# EAGLE design Lawnbot400_arduino33 (EAGLE 5.06)
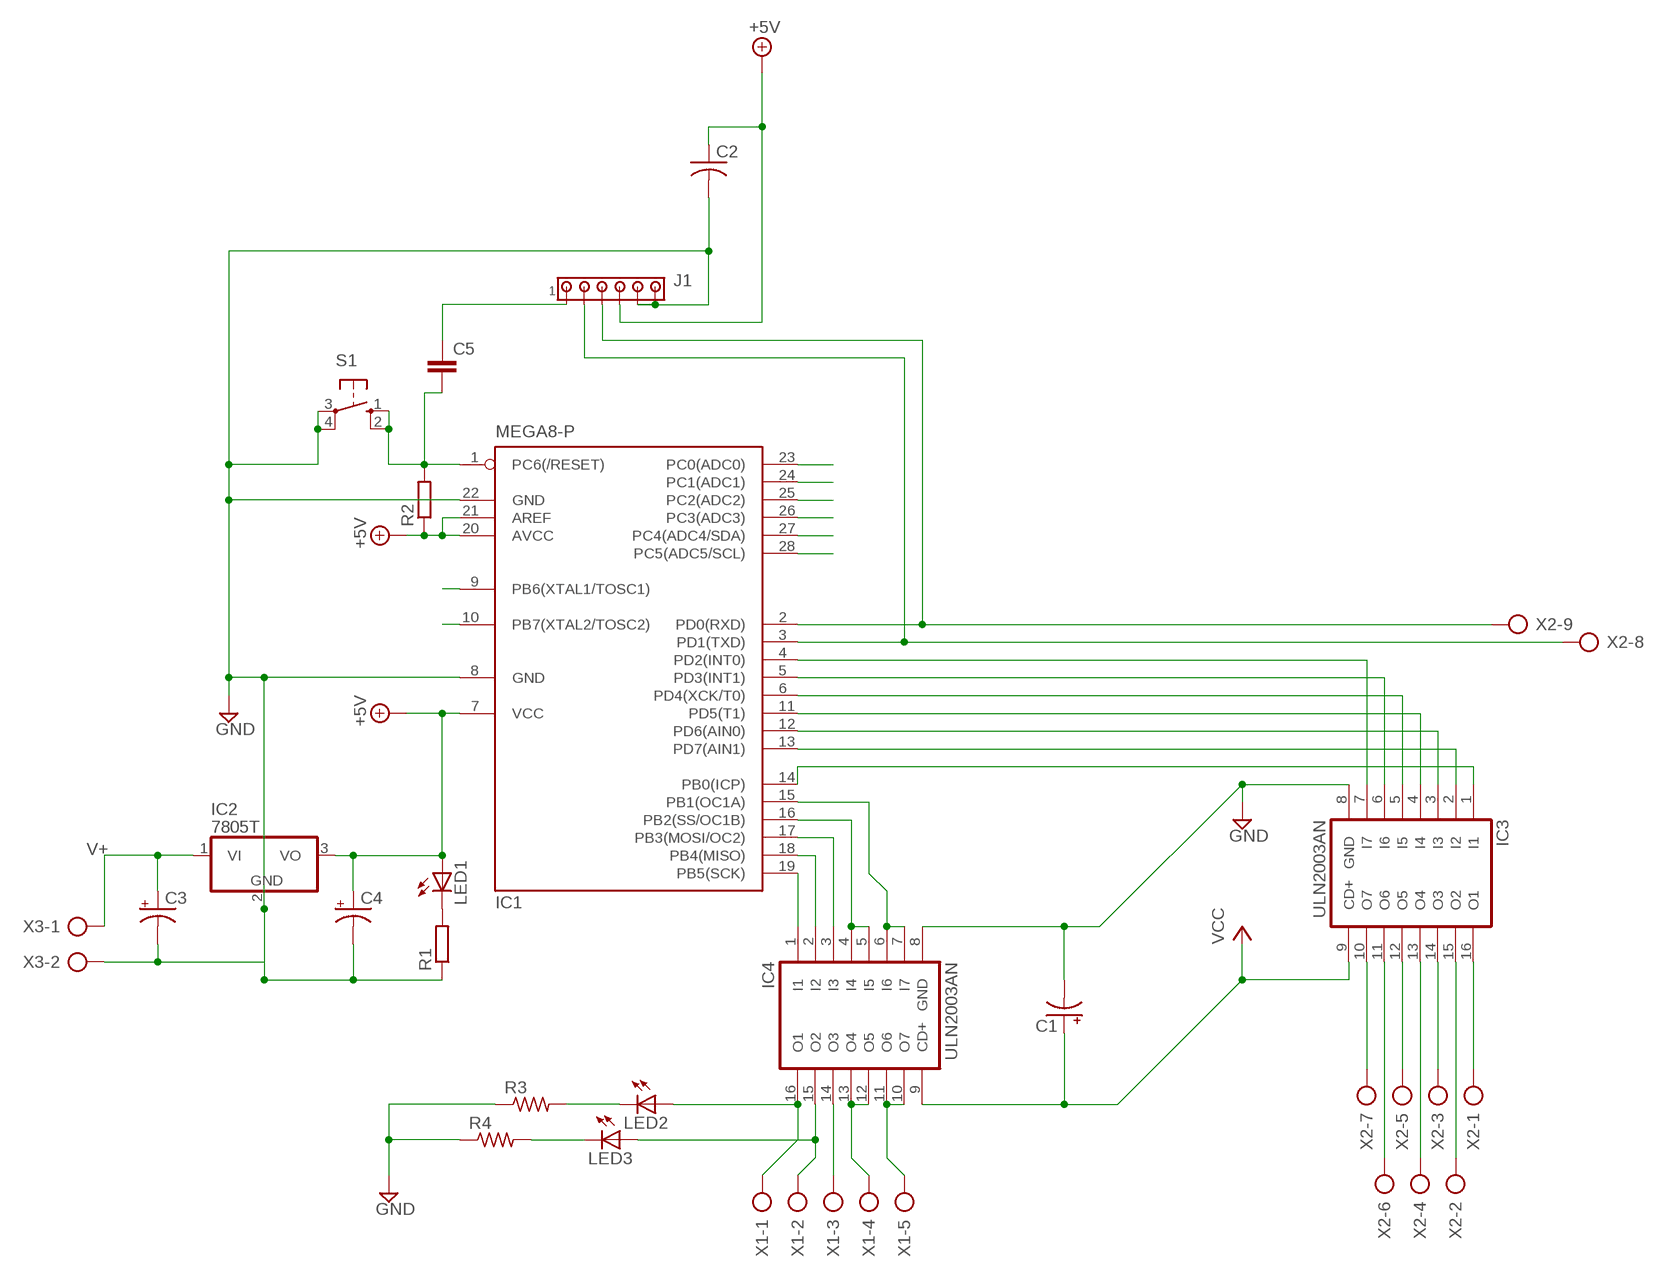
[diagram p0: schematic, sheet 1]

## Parts
C1  CPOL-USE2.5-6  [E2,5-6]
C2  C-US025-024X044  [C025-024X044]
C3  CPOL-USE2.5-6  [E2,5-6]
C4  CPOL-USE2.5-7  [E2,5-7]
C5  C-EU075-042X103  [C075-042X103]
IC1  MEGA8-P  [DIL28-3]
IC2  7805T  [TO220H]
IC3  ULN2003AN  [DIL16]
IC4  ULN2003AN  [DIL16]
J1  MTA06-100  [10X06MTA]
LED1  LED3MM  [LED3MM]
LED2  LED3MM  [LED3MM]
LED3  LED3MM  [LED3MM]
R1  R-EU_0204/5  [0204/5]
R2  R-EU_0204/5  [0204/5]
R3  R-US_0204/5  [0204/5]
R4  R-US_0204/5  [0204/5]
S1  10-XX  [B3F-10XX]
X1  AK500/5  [AK500/5]
X2  AK500/9  [AK500/9]
X3  AK500/2  [AK500/2]

## Nets
+5V: C2.1 C4.+ IC1.7(VCC) IC1.20(AVCC) IC1.21(AREF) IC2.3(VO) J1.3 LED1.A R2.1
GND: C1.- C2.2 C3.- C4.- IC1.8(GND) IC1.22(GND) IC2.2(GND) IC3.8(GND) IC4.8(GND) J1.1 J1.2 R1.1 R3.1 R4.1 S1.3(P) S1.4(P1) X3.2
N$1: LED1.K(C) R1.2
N$2: C5.2 IC1.1(PC6(/RESET)) R2.2 S1.1(S) S1.2(S1)
N$3: IC4.16(O1) LED2.A X1.1
N$4: C5.1 J1.6
N$5: IC1.5(PD3(INT1)) IC3.6(I6)
N$6: IC1.4(PD2(INT0)) IC3.7(I7)
N$7: IC1.10(PB7(XTAL2/TOSC2))
N$8: IC3.16(O1) X2.1
N$9: IC1.2(PD0(RXD)) J1.4 X2.9
N$10: IC1.3(PD1(TXD)) J1.5 X2.8
N$11: IC1.6(PD4(XCK/T0)) IC3.5(I5)
N$12: IC1.11(PD5(T1)) IC3.4(I4)
N$13: IC1.12(PD6(AIN0)) IC3.3(I3)
N$14: IC1.13(PD7(AIN1)) IC3.2(I2)
N$15: IC1.14(PB0(ICP)) IC3.1(I1)
N$16: IC1.15(PB1(OC1A)) IC4.6(I6) IC4.7(I7)
N$17: IC1.16(PB2(SS/OC1B)) IC4.4(I4) IC4.5(I5)
N$18: IC1.17(PB3(MOSI/OC2)) IC4.3(I3)
N$19: IC1.18(PB4(MISO)) IC4.2(I2)
N$20: IC1.19(PB5(SCK)) IC4.1(I1)
N$21: IC3.15(O2) X2.2
N$22: IC3.14(O3) X2.3
N$23: IC1.28(PC5(ADC5/SCL))
N$24: IC1.27(PC4(ADC4/SDA))
N$25: IC1.26(PC3(ADC3))
N$26: IC1.25(PC2(ADC2))
N$27: IC1.24(PC1(ADC1))
N$28: IC1.23(PC0(ADC0))
N$29: IC3.13(O4) X2.4
N$30: IC3.12(O5) X2.5
N$31: IC3.11(O6) X2.6
N$32: IC3.10(O7) X2.7
N$33: IC1.9(PB6(XTAL1/TOSC1))
N$34: IC4.15(O2) LED3.A X1.2
N$35: IC4.14(O3) X1.3
N$36: IC4.12(O5) IC4.13(O4) X1.4
N$38: LED2.K(C) R3.2
N$39: IC4.10(O7) IC4.11(O6) X1.5
N$41: LED3.K(C) R4.2
V+: C3.+ IC2.1(VI) X3.1
VCC: C1.+ IC3.9(CD+) IC4.9(CD+)

## Library data of the parts
C1 C3 C4 = rcl:CPOL-US: POLARIZED CAPACITOR, American symbol
C2 = rcl:C-US: CAPACITOR, American symbol
C5 = rcl:C-EU: CAPACITOR, European symbol
IC1 = atmel:MEGA8-P: MICROCONTROLLER 8 Kbytes FLASH, 1 kbytes SRAM, 512 bytes EEPROM, USART, 4-channel 10 bit ADC, 2-channel 8 bit ADC Pin compatible with Atmega48, ATMega88, ATMega168 Source: avr.lbr
IC2 = linear:78*: Positive VOLTAGE REGULATOR Source: http://cache.national.com/ds/LM/LM78L05.pdf http://www.fairchildsemi.com/ds/LM/LM7805.pdf
IC3 IC4 = uln-udn:ULN2003A: DRIVER ARRAY
J1 = con-amp:MTA06-100: AMP connector
LED1-LED3 = led:LED: LED OSRAM: - CHIPLED LG R971, LG N971, LY N971, LG Q971, LY Q971, LO R971, LY R971 LH N974, LH R974 LS Q976, LO Q976, LY Q976 LO Q996 - Hyper CHIPLED LW Q18S LB Q993, LB Q99A, LB R99A - SideLED LS A670, LO A670, LY A670, LG A670, LP A670 LB A673, LV A673, LT A673, LW A673 LH A674 LY A675 LS A676, LA A676, LO A676, LY A676, LW A676 LS A679, LY A679, LG A679 - Hyper Micro SIDELED® LS Y876, LA Y876, LO Y876, LY Y876 LT Y87S - SmartLED LW L88C, LW L88S LB L89C, LB L89S, LG L890 LS L89K, LO L89K, LY L89K LS L896, LA L896, LO L896, LY L896 - TOPLED LS T670, LO T670, LY T670, LG T670, LP T670 LSG T670, LSP T670, LSY T670, LOP T670, LYG T670 LG T671, LOG T671, LSG T671 LB T673, LV T673, LT T673, LW T673 LH T674 LS T676, LA T676, LO T676, LY T676, LB T676, LH T676, LSB T676, LW T676 LB T67C, LV T67C, LT T67C, LS T67K, LO T67K, LY T67K, LW E67C LS E67B, LA E67B, LO E67B, LY E67B, LB E67C, LV E67C, LT E67C LW T67C LS T679, LY T679, LG T679 LS T770, LO T770, LY T770, LG T770, LP T770 LB T773, LV T773, LT T773, LW T773 LH T774 LS E675, LA E675, LY E675, LS T675 LS T776, LA T776, LO T776, LY T776, LB T776 LHGB T686 LT T68C, LB T68C - Hyper Mini TOPLED® LB M676 - Mini TOPLED Santana® LG M470 LS M47K, LO M47K, LY M47K Source: http://www.osram.convergy.de LUXEON: - LUMILED® LXK2-PW12-R00, LXK2-PW12-S00, LXK2-PW14-U00, LXK2-PW14-V00 LXK2-PM12-R00, LXK2-PM12-S00, LXK2-PM14-U00 LXK2-PE12-Q00, LXK2-PE12-R00, LXK2-PE12-S00, LXK2-PE14-T00, LXK2-PE14-U00 LXK2-PB12-K00, LXK2-PB12-L00, LXK2-PB12-M00, LXK2-PB14-N00, LXK2-PB14-P00, LXK2-PB14-Q00 LXK2-PR12-L00, LXK2-PR12-M00, LXK2-PR14-Q00, LXK2-PR14-R00 LXK2-PD12-Q00, LXK2-PD12-R00, LXK2-PD12-S00 LXK2-PH12-R00, LXK2-PH12-S00 LXK2-PL12-P00, LXK2-PL12-Q00, LXK2-PL12-R00 Source: www.luxeon.com KINGBRIGHT: KA-3528ASYC Source: www.kingbright.com
R1 R2 = resistor:R-EU_: RESISTOR, European symbol
R3 R4 = resistor:R-US_: RESISTOR, American symbol
S1 = switch-omron:10-XX: OMRON SWITCH
X1 = con-ptr500:AK500/5: CONNECTOR
X2 = con-ptr500:AK500/9: CONNECTOR
X3 = con-ptr500:AK500/2: CONNECTOR

## Board
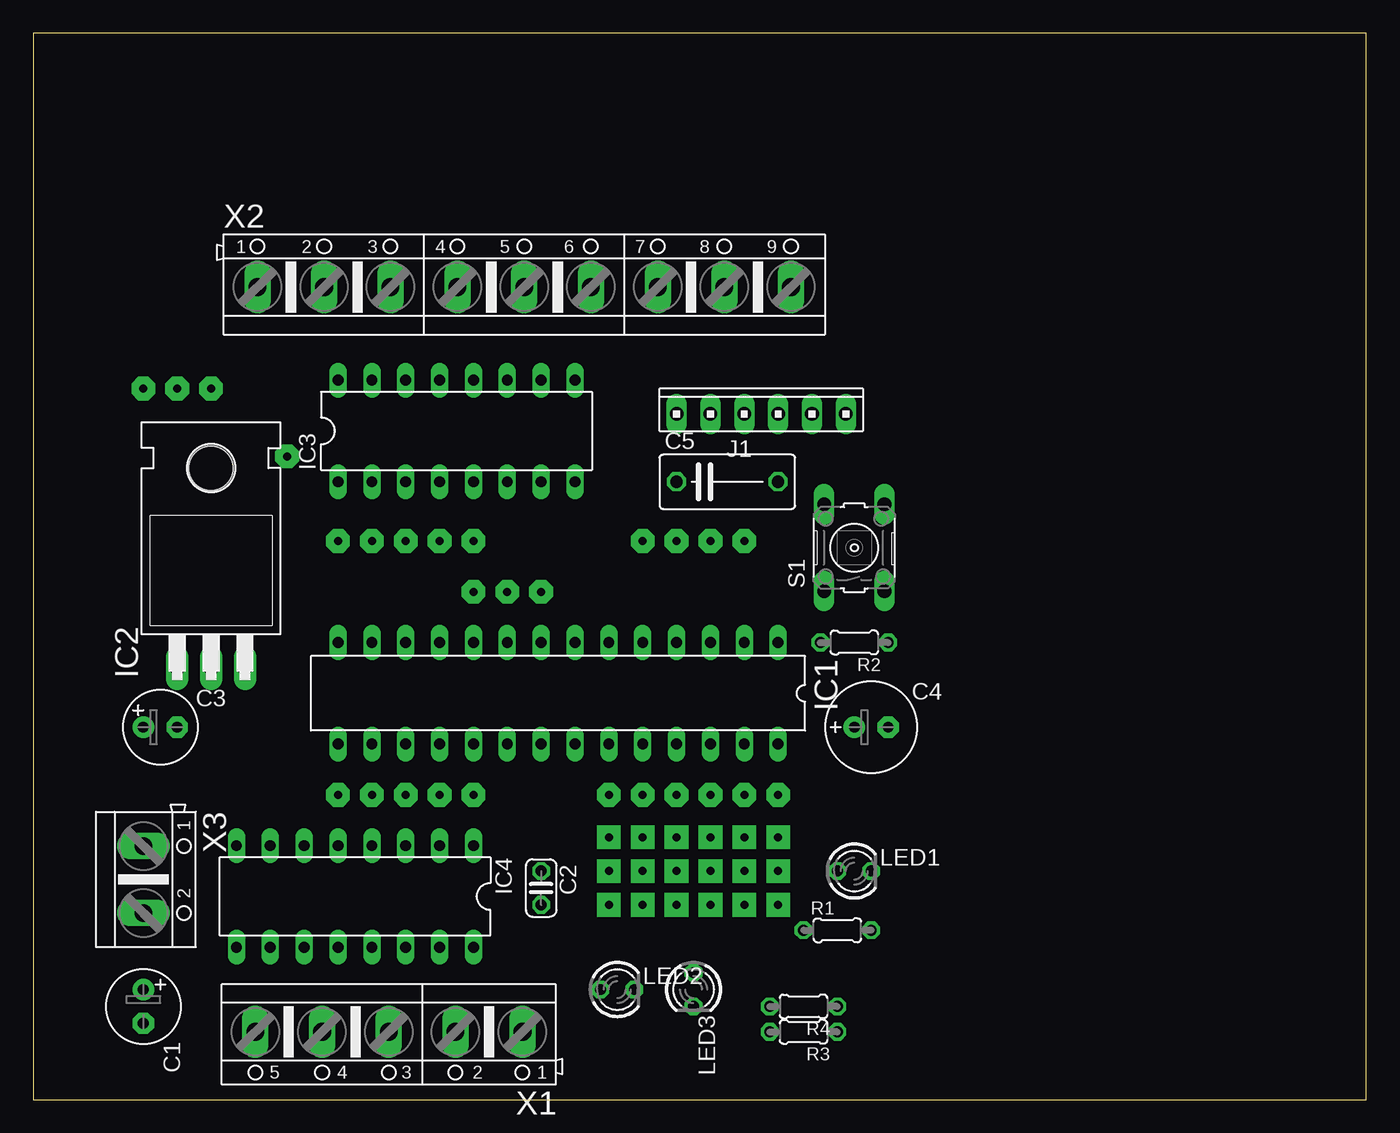
[diagram p1: board, top side]
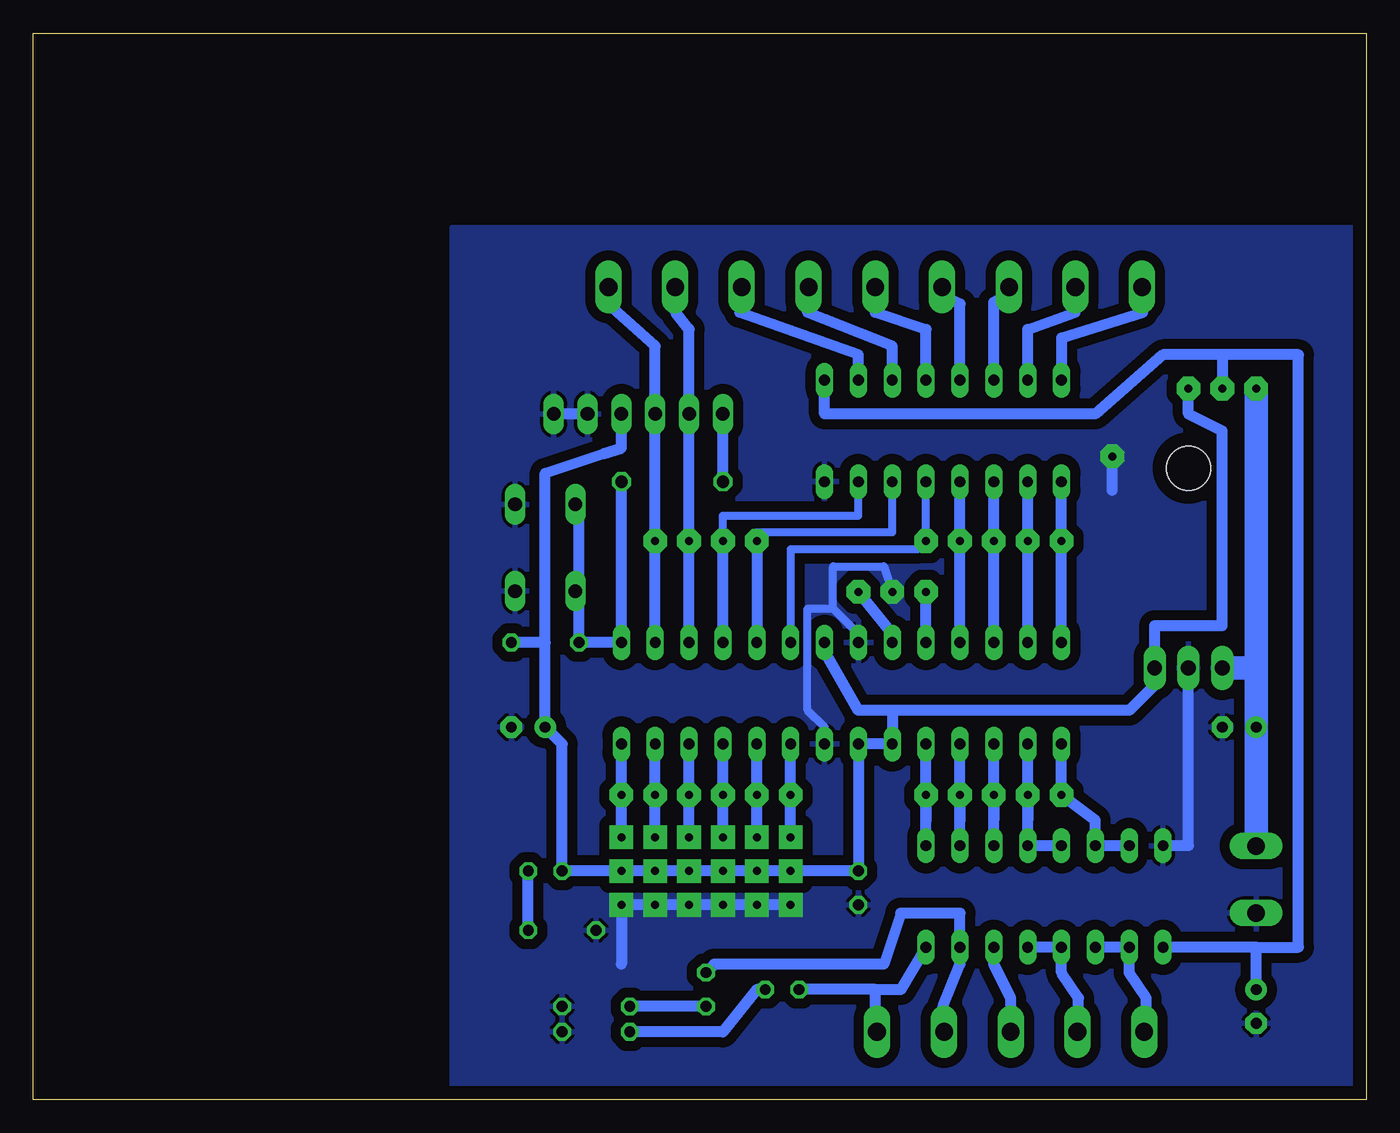
[diagram p2: board, bottom side, seen from below]

Size 100 x 80 mm. Coordinates in mm from the lower left corner, seen from the top.
Outline: 0,0 100,0 100,80 0,80 0,0
Copper layers (1*16): Top 0.035mm / dielectric 1.5mm / Bottom 0.035mm
Design rules "default *": minimum track width 10mil, minimum drill 24mil, track to track 30mil, track to pad 30mil, pad to pad 8mil, via to via 8mil, smd to smd 8mil, copper to edge 40mil, drill to drill 8mil, minimum pad ring 10mil, minimum via ring 8mil, stop-mask expansion 4mil, vias tented up to drill 0mil, thermal gap 10mil

### Footprints (pad centres in the part's own frame; a part is rotated, then mirrored left to right if it is on the bottom)
E2,5-6 = drill 0.813 pad 1.6 round: + -1.27,0 | drill 0.813 pad 1.6 octagon: - 1.27,0
C025-024X044 = drill 0.813 octagon: 1 -1.27,0; 2 1.27,0
E2,5-7 = drill 0.813 pad 1.6 round: + -1.27,0 | drill 0.813 pad 1.6 octagon: - 1.27,0
C075-042X103 = drill 0.914 octagon: 1 -3.81,0; 2 3.81,0
DIL28-3 = drill 0.813 long: 1 -16.51,-3.81; 2 -13.97,-3.81; 3 -11.43,-3.81; 4 -8.89,-3.81; 5 -6.35,-3.81; 6 -3.81,-3.81; 7 -1.27,-3.81; 8 1.27,-3.81; 9 3.81,-3.81; 10 6.35,-3.81; 11 8.89,-3.81; 12 11.43,-3.81; 13 13.97,-3.81; 14 16.51,-3.81; 15 16.51,3.81; 16 13.97,3.81; 17 11.43,3.81; 18 8.89,3.81; 19 6.35,3.81; 20 3.81,3.81; 21 1.27,3.81; 22 -1.27,3.81; 23 -3.81,3.81; 24 -6.35,3.81; 25 -8.89,3.81; 26 -11.43,3.81; 27 -13.97,3.81; 28 -16.51,3.81
TO220H = drill 1.118 long: 1 -2.54,-10.16; 2 0,-10.16; 3 2.54,-10.16 | hole 3.302: 0,4.826
DIL16 = drill 0.813 long: 1 -8.89,-3.81; 2 -6.35,-3.81; 3 -3.81,-3.81; 4 -1.27,-3.81; 5 1.27,-3.81; 6 3.81,-3.81; 7 6.35,-3.81; 8 8.89,-3.81; 9 8.89,3.81; 10 6.35,3.81; 11 3.81,3.81; 12 1.27,3.81; 13 -1.27,3.81; 14 -3.81,3.81; 15 -6.35,3.81; 16 -8.89,3.81
10X06MTA = drill 1.016 long: 1 6.35,0; 2 3.81,0; 3 1.27,0; 4 -1.27,0; 5 -3.81,0; 6 -6.35,0
LED3MM = drill 0.813 octagon: A -1.27,0; K 1.27,0
0204/5 = drill 0.813 octagon: 1 -2.54,0; 2 2.54,0
B3F-10XX = drill 1.016 long: 1 -3.251,2.261; 2 3.251,2.261; 3 -3.251,-2.261; 4 3.251,-2.261
AK500/5 = drill 1.321 long: 1 -10.033,0; 2 -5.004,0; 3 0,0; 4 5.004,0; 5 10.008,0
AK500/9 = drill 1.321 long: 1 -20.015,0; 2 -15.011,0; 3 -10.033,0; 4 -5.004,0; 5 0,0; 6 5.004,0; 7 10.033,0; 8 15.011,0; 9 20.015,0
AK500/2 = drill 1.321 long: 1 -2.515,0; 2 2.515,0

### Placement (x,y rotation side)
C1  8.26,6.99 270 top
C2  38.1,15.88 270 top
C3  9.53,27.94 0 top
C4  62.87,27.94 0 top
C5  52.07,46.35 0 top
IC1  39.37,30.48 180 top
IC2  13.34,42.55 0 top
IC3  31.75,50.16 0 top
IC4  24.13,15.24 180 top
J1  54.61,51.44 0 top
LED1  61.59,17.14 0 top
LED2  43.81,8.26 0 top
LED3  49.53,8.26 270 top
R1  60.33,12.7 0 top
R2  61.59,34.29 180 top
R3  57.78,5.08 180 top
R4  57.78,6.99 180 top
S1  61.59,41.4 90 top
X1  26.67,5.08 180 top
X2  36.83,60.96 0 top
X3  8.26,16.51 270 top

### Tracks (layer width: path | path; a pad name or v marks a point on that pad's centre or on a via)
+5V  (via drill 0.6 pad 1.78)
  Bottom 0.254: 55.88,48.9 57.15,48.26 57.21,48.45
  Bottom 0.813: 61.59,34.29 61.59,46.99 57.21,48.45 55.88,48.9 J1.3 | IC1.7 40.64,33.66 38.1,29.21 35.56,29.21 | 35.56,29.21 17.78,29.21 15.88,31.11 IC2.3 15.88,35.56 10.79,35.56 10.79,50.16 13.34,51.44 v13.34,53.34 | 35.56,29.21 IC1.20 IC1.21 C2.1 LED1.A 60.33,26.67 C4.+ 61.59,34.29 | 61.59,34.29 R2.1
GND  (via drill 0.6 pad 1.78)
  Bottom 0.61: 40.01,36.83 38.1,34.92 | 40.01,36.83 41.91,36.83 41.91,29.21 40.64,27.94 IC1.22 | 40.01,36.83 40.01,40.01 36.2,40.01 v35.56,38.1
  Bottom 0.813: 13.34,31.75 IC2.2 13.34,19.05 IC4.8 | 38.1,34.92 IC1.8 | v43.18,14.61 v45.72,14.61 v48.26,14.61 v50.8,14.61 v53.34,14.61 v55.88,14.61 55.88,10.16 | 19.05,45.72 v19.05,48.26 | J1.2 J1.1 J1.2
  pour Bottom: 0.64,65.41 68.58,65.41 68.58,0.64 0.64,0.64
N$1
  Bottom 0.813: R1.2 LED1.K
N$2
  Bottom 0.813: C5.2 IC1.1 R2.2 59.05,37.47 S1.1 59.05,38.73 59.05,43.81 S1.2
N$3
  Bottom 0.813: IC4.16 34.92,8.26 36.83,8.26 | X1.1 36.83,5.08 36.83,8.26 | 36.83,8.26 LED2.A
N$4
  Bottom 0.813: C5.1 J1.6
N$5  (via drill 0.6 pad 1.78)
  Bottom 0.61: IC3.6 35.56,42.55 45.72,42.55 v45.72,41.91
  Bottom 0.813: v45.72,41.91 IC1.5
N$6  (via drill 0.6 pad 1.78)
  Bottom 0.61: v48.26,41.91 48.26,43.81 38.1,43.81 IC3.7
  Bottom 0.813: IC1.4 v48.26,41.91
N$7  (via drill 0.6 pad 1.78)
  Bottom 0.813: IC1.10 v33.02,38.1
N$8
  Bottom 0.813: IC3.16 22.86,57.15 16.76,59.05 16.76,60.96 X2.1
N$9  (via drill 0.6 pad 1.78)
  Bottom 0.813: v53.34,41.91 IC1.2 v53.34,41.91 | v53.34,41.91 J1.4 | v53.34,41.91 53.34,56.52 56.9,59.69 X2.9
N$10  (via drill 0.6 pad 1.78)
  Bottom 0.813: v50.8,41.91 IC1.3 v50.8,41.91 | v50.8,41.91 J1.5 | J1.5 50.8,57.78 51.82,59.05 X2.8 52.07,60.96 | v50.8,41.91 J1.5
N$11  (via drill 0.6 pad 1.78)
  Bottom 0.61: IC3.5 v33.02,41.91 33.66,41.27 43.18,41.27 IC1.6
N$12  (via drill 0.6 pad 1.78)
  Bottom 0.813: IC1.11 v30.48,41.91 IC3.4
N$13  (via drill 0.6 pad 1.78)
  Bottom 0.813: IC1.12 v27.94,41.91 IC3.3
N$14  (via drill 0.6 pad 1.78)
  Bottom 0.813: IC1.13 v25.4,41.91 IC3.2
N$15  (via drill 0.6 pad 1.78)
  Bottom 0.813: IC1.14 v22.86,41.91 IC3.1
N$16  (via drill 0.6 pad 1.78)
  Bottom 0.813: IC1.15 v22.86,22.86 20.32,20.95 IC4.6 IC4.7
N$17  (via drill 0.6 pad 1.78)
  Bottom 0.813: v25.4,22.86 IC1.16 v25.4,22.86 | v25.4,22.86 25.4,20.95 | v25.4,22.86 IC4.4 IC4.5
N$18  (via drill 0.6 pad 1.78)
  Bottom 0.813: v27.94,22.86 IC1.17 v27.94,22.86 | v27.94,22.86 27.94,20.95 | IC4.3 v27.94,22.86
N$19  (via drill 0.6 pad 1.78)
  Bottom 0.813: v30.48,22.86 IC1.18 v30.48,22.86 | v30.48,22.86 30.48,20.95 | IC4.2 v30.48,22.86
N$20  (via drill 0.6 pad 1.78)
  Bottom 0.813: v33.02,22.86 IC1.19 v33.02,22.86 | v33.02,22.86 33.02,20.95 | IC4.1 v33.02,22.86
N$21
  Bottom 0.813: IC3.15 25.4,57.78 21.84,59.05 X2.2 21.59,60.96
N$22
  Bottom 0.813: IC3.14 27.94,59.82 26.8,60.45 X2.3 26.67,60.96
N$23  (via drill 0.6 pad 1.78)
  Bottom 0.813: v55.88,19.68 v55.88,22.86 IC1.28
N$24  (via drill 0.6 pad 1.78)
  Bottom 0.813: v53.34,19.68 v53.34,22.86 IC1.27
N$25  (via drill 0.6 pad 1.78)
  Bottom 0.813: v50.8,19.68 v50.8,22.86 IC1.26
N$26  (via drill 0.6 pad 1.78)
  Bottom 0.813: v48.26,19.68 v48.26,22.86 IC1.25
N$27  (via drill 0.6 pad 1.78)
  Bottom 0.813: v45.72,19.68 v45.72,22.86 IC1.24
N$28  (via drill 0.6 pad 1.78)
  Bottom 0.813: v43.18,19.68 v43.18,22.86 IC1.23
N$29
  Bottom 0.813: IC3.13 30.48,59.69 31.75,60.33 X2.4
N$30
  Bottom 0.813: IC3.12 33.02,57.78 36.83,59.05 X2.5
N$31
  Bottom 0.813: IC3.11 35.56,56.52 41.91,59.05 41.91,60.96 X2.6
N$32
  Bottom 0.813: IC3.10 38.1,55.88 46.99,59.05 46.99,60.96 X2.7
N$33  (via drill 0.6 pad 1.78)
  Bottom 0.813: IC1.9 35.56,34.92 v38.1,38.1
N$34
  Bottom 0.813: X1.2 31.75,5.08 31.75,6.99 30.48,10.16 IC4.15 30.48,13.97 34.92,13.97 36.2,10.16 48.9,10.16 LED3.A
N$35
  Bottom 0.813: IC4.14 27.94,10.16 26.67,7.62 X1.3
N$36
  Bottom 0.813: IC4.13 IC4.12 22.86,9.53 21.59,7.62 21.59,5.08 X1.4
N$37  (via drill 0.6 pad 1.78)
  other vias: 43.18,17.14
N$38
  Bottom 0.813: R3.2 48.26,5.08 45.72,8.26 LED2.K
N$39
  Bottom 0.813: IC4.11 IC4.10 17.78,9.53 16.51,7.62 16.51,5.08 X1.5
N$40  (via drill 0.6 pad 1.78)
  other vias: 45.72,17.14
N$41
  Bottom 0.813: LED3.K R4.2
N$43  (via drill 0.6 pad 1.78)
  other vias: 48.26,17.14
N$46  (via drill 0.6 pad 1.78)
  other vias: 50.8,17.14
N$49  (via drill 0.6 pad 1.78)
  other vias: 53.34,17.14
N$52  (via drill 0.6 pad 1.78)
  other vias: 55.88,17.14
V+  (via drill 0.6 pad 1.78)
  Bottom 0.254: C3.+ 8.89,27.94
  Bottom 1.778: 8.26,32.38 IC2.1 | X3.1 C3.+ 8.26,32.38 | 8.26,32.38 v8.26,53.34
VCC  (via drill 0.6 pad 1.78)
  Bottom 0.813: IC3.9 40.64,51.44 20.32,51.44 15.24,55.88 10.79,55.88 | 8.26,11.43 5.08,11.43 5.08,55.88 10.79,55.88 | 8.26,11.43 IC4.9 | 10.79,55.88 v10.79,53.34 | C1.+ 8.26,11.43